# EasyEDA schematic SCH_Media-Remote_2024-07-10.json
TITLE: LoeMediaRemote; REV: 1.0; Date: 2024-07-08; Sheet: 1/1
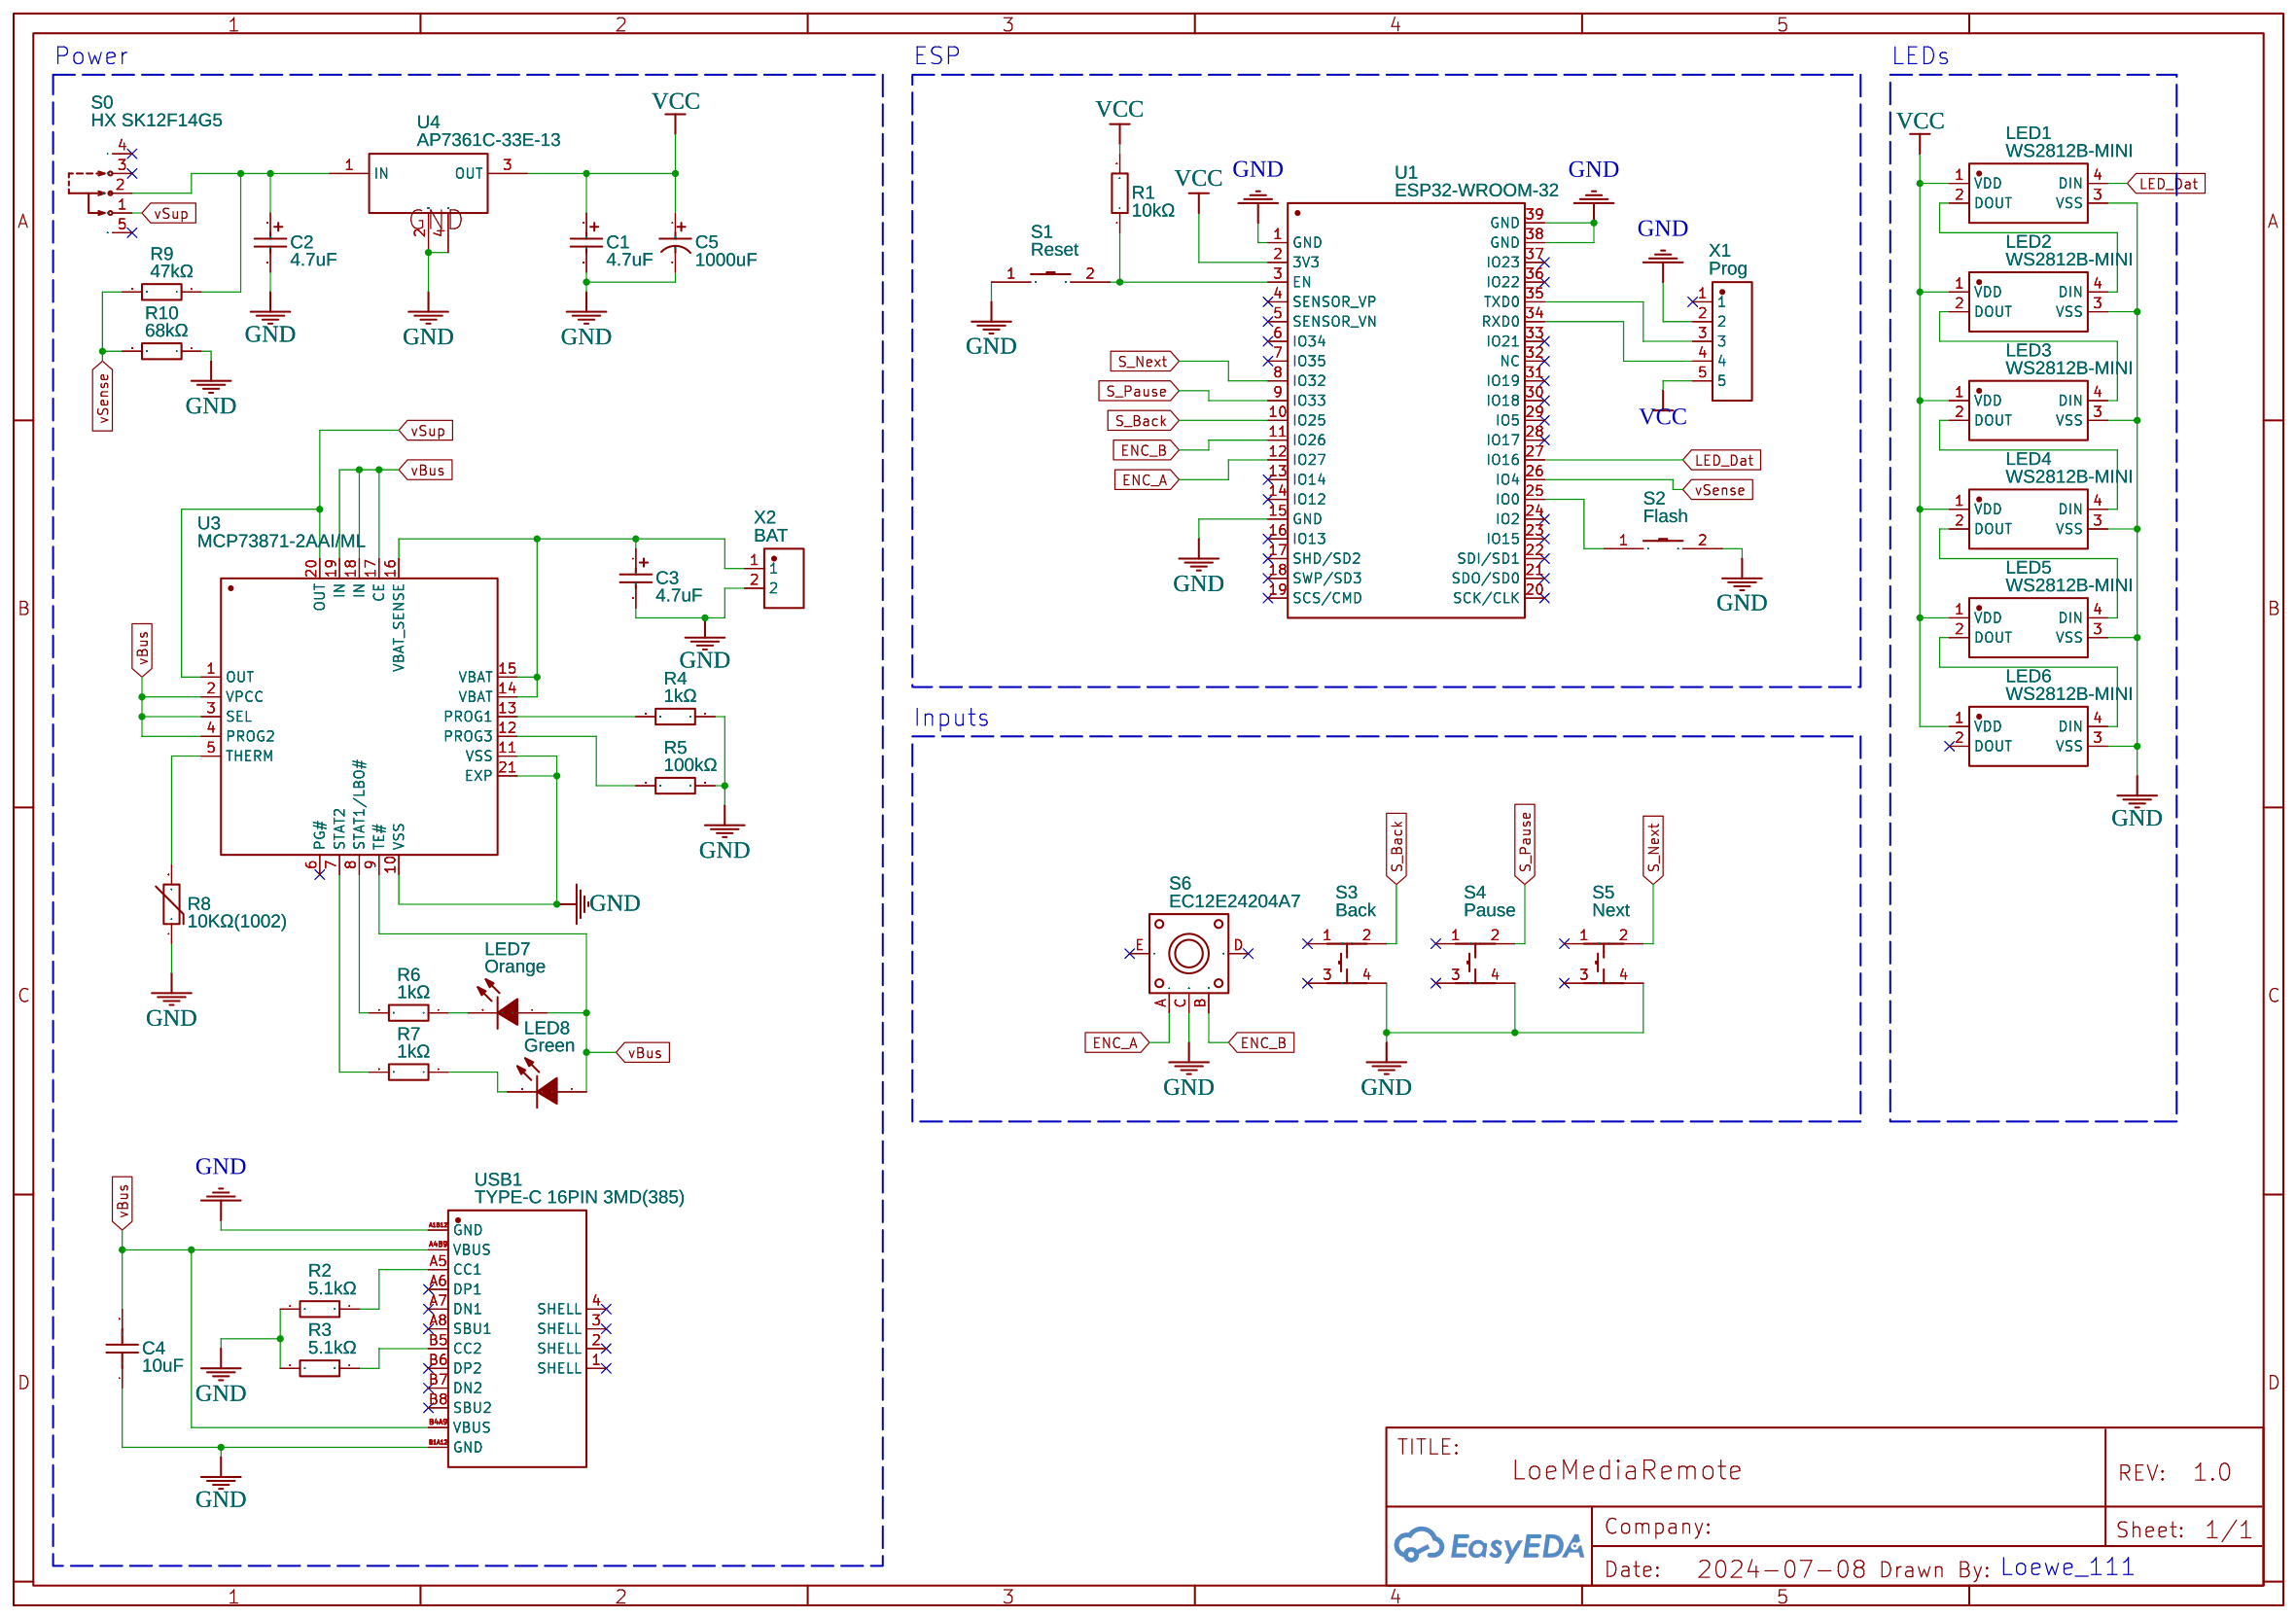
[diagram p0: schematic sheet]

## Parts
C1  4.7uF  [CASE-A_3216]
C2  4.7uF  [CASE-A_3216]
C3  4.7uF  [CASE-A_3216]
C4  10uF  [C0603]
C5  1000uF  [CAP-SMD_BD10.0-L10.3-W10.3-LS11.3-FD]
LED1  WS2812B-MINI  [LED-SMD_4P-L3.5-W3.5-TL_WS2812B]
LED2  WS2812B-MINI  [LED-SMD_4P-L3.5-W3.5-TL_WS2812B]
LED3  WS2812B-MINI  [LED-SMD_4P-L3.5-W3.5-TL_WS2812B]
LED4  WS2812B-MINI  [LED-SMD_4P-L3.5-W3.5-TL_WS2812B]
LED5  WS2812B-MINI  [LED-SMD_4P-L3.5-W3.5-TL_WS2812B]
LED6  WS2812B-MINI  [LED-SMD_4P-L3.5-W3.5-TL_WS2812B]
LED7  Orange  [LED0603-R-RD_ORANGE]
LED8  Green  [LED0603-R-RD_GREEN]
R1  10kΩ  [R0603]
R2  5.1kΩ  [R0603]
R3  5.1kΩ  [R0603]
R4  1kΩ  [R0603]
R5  100kΩ  [R0603]
R6  1kΩ  [R0603]
R7  1kΩ  [R0603]
R8  10KΩ(1002)  [R0603]
R9  47kΩ  [R0603]
R10  68kΩ  [R0603]
S0  HX SK12F14G5  [SW-TH_SK12F14G5]
S1  Reset  [SW-SMD_L6.0-W3.3-LS8.0]
S2  Flash  [SW-SMD_L6.0-W3.3-LS8.0]
S3  Back  [KEY-SMD_4P-L12.0-W12.0-P5.00-LS15.2]
S4  Pause  [KEY-SMD_4P-L12.0-W12.0-P5.00-LS15.2]
S5  Next  [KEY-SMD_4P-L12.0-W12.0-P5.00-LS15.2]
S6  EC12E24204A7  [SW-TH_EC12EXXXX]
U1  ESP32-WROOM-32  [WIFIM-SMD_ESP32-WROOM-32-N4]
U3  MCP73871-2AAI/ML  [QFN-20_L4.0-W4.0-P0.50-TL-EP2.6]
U4  AP7361C-33E-13  [SOT-223_L6.5-W3.5-P2.30-LS7.0-BR]
USB1  TYPE-C 16PIN 3MD(385)  [USB-C-SMD_TYPE-C16PIN]
X1  Prog  [HDR-SMD_X6511WVS-05H-C60D48R1]
X2  BAT  [CONN-TH_2P-P2.50_HX25003-2A]

## Library data of the parts
C1-C3 = CA45-A-16V-4.7UF-K: Contributor: LCSC; Supplier: LCSC; Manufacturer: CEC(振华新云); Manufacturer Part: CA45-A-16V-4.7uF-K; Supplier Part: C129235; JLCPCB Part Class: Extended Part
C4 = CL10A106MP8NNNC: Supplier: LCSC; Manufacturer: SAMSUNG(三星); Supplier Part: C85713; JLCPCB Part Class: Extended Part
C5 = RVT1C102M1010: Supplier: LCSC; Manufacturer: ROQANG(容强); Supplier Part: C72470; JLCPCB Part Class: Extended Part
LED1-LED6 = WS2812B-MINI: Contributor: LCSC; Supplier: LCSC; Supplier Part: C527089; Manufacturer: worldsemi; Manufacturer Part: WS2812B-MINI-V3/W; JLCPCB Part Class: Extended Part
LED7 = SZYY0603O: Contributor: LCSC; Supplier: LCSC; Supplier Part: C434425; Manufacturer: yongyu(永裕光电); JLCPCB Part Class: Extended Part
LED8 = SZYY0603G: Contributor: LCSC; Supplier: LCSC; Supplier Part: C434420; Manufacturer: yongyu(永裕光电); JLCPCB Part Class: Extended Part
R1 = 0603WAF1002T5E: Supplier: LCSC; Manufacturer: UNI-ROYAL(厚声); Supplier Part: C25804; JLCPCB Part Class: Basic Part
R2 R3 = 0603WAF5101T5E: Supplier: LCSC; Manufacturer: UNI-ROYAL(厚声); Supplier Part: C23186; JLCPCB Part Class: Basic Part
R4 R6 R7 = RC0603FR-071KL: Supplier: LCSC; Manufacturer: YAGEO(国巨); Supplier Part: C22548; JLCPCB Part Class: Extended Part
R5 = RC0603FR-07100KL: Contributor: LCSC; Supplier: LCSC; Supplier Part: C14675; Manufacturer: YAGEO(国巨); JLCPCB Part Class: Extended Part
R8 = NCP18XH103F03RB: Supplier: LCSC; Manufacturer: muRata(村田); Supplier Part: C13564; JLCPCB Part Class: Extended Part
R9 = RC0603FR-0747KL: Supplier: LCSC; Manufacturer: YAGEO(国巨); Supplier Part: C105579; JLCPCB Part Class: Extended Part
R10 = RC0603FR-0768KL: JLCPCB Part Class: Extended Part; Supplier: LCSC; Manufacturer: YAGEO(国巨); Supplier Part: C114633
S0 = HX SK12F14G5: Contributor: lcsc; Supplier: LCSC; Supplier Part: C5149842; Manufacturer: hanxia(韩下); JLCPCB Part Class: Extended Part
S1 S2 = TS-1101-C-W: Contributor: LCSC; Supplier: LCSC; Supplier Part: C318938; Manufacturer: XKB Connectivity(中国星坤); JLCPCB Part Class: Extended Part
S3-S5 = TS-1094TS-B3D2: Contributor: lcsc; Supplier: LCSC; Supplier Part: C5148426; Manufacturer: Yuandi(元迪); JLCPCB Part Class: Extended Part
S6 = EC12E24204A7: Contributor: LCSC; Supplier: LCSC; Supplier Part: C470597; Manufacturer: ALPSALPINE(阿尔卑斯阿尔派); JLCPCB Part Class: Extended Part
U1 = ESP32-WROOM-32: Contributor: LCSC; Supplier: LCSC; Supplier Part: C82899; Manufacturer: ESPRESSIF(乐鑫); Manufacturer Part: ESP32-WROOM-32-N4; JLCPCB Part Class: Extended Part
U3 = MCP73871-2AAI/ML: Contributor: LCSC; Supplier: LCSC; Manufacturer: MICROCHIP(美国微芯); Supplier Part: C144351; JLCPCB Part Class: Extended Part
U4 = AP7361C-33E-13: Contributor: LCSC; Supplier: LCSC; Supplier Part: C500795; Manufacturer: Diodes Incorporated; JLCPCB Part Class: Extended Part
USB1 = TYPE-C 16PIN 3MD(385): Contributor: LCSC; Supplier: LCSC; Supplier Part: C2858270; Manufacturer: SHOU HAN(首韩); JLCPCB Part Class: Extended Part
X1 = X6511WVS-05H-C60D48R1: Contributor: LCSC; Supplier: LCSC; Supplier Part: C2883802; Manufacturer: XKB Connection(中国星坤); JLCPCB Part Class: Extended Part
X2 = ZX-XH2.54-2PZZ: Supplier: LCSC; Supplier Part: C7429632; Manufacturer: Megastar(兆星); JLCPCB Part Class: Extended Part; Contributor: lcsc

## Nets
GND: C1.2 C2.2 C3.2 C4.1 C5.2 LED1.3(VSS) LED2.3(VSS) LED3.3(VSS) LED4.3(VSS) LED5.3(VSS) LED6.3(VSS) R2.2 R3.2 R4.1 R5.1 R8.1 R10.1 S1.1 S2.2 S3.4 S4.4 S5.4 S6.C U1.1(GND) U1.15(GND) U1.38(GND) U1.39(GND) U3.10(VSS) U3.11(VSS) U3.21(EXP) U4.2(GND) U4.4(GND) USB1.A1B12(GND) USB1.B1A12(GND) X1.2 X2.2
vBus: C4.2 LED7.1(+) LED8.1(+) U3.2(VPCC) U3.3(SEL) U3.4(PROG2) U3.9(TE#) U3.17(CE) U3.18(IN) U3.19(IN) USB1.A4B9(VBUS) USB1.B4A9(VBUS)
VCC: C1.1 C5.1 LED1.1(VDD) LED2.1(VDD) LED3.1(VDD) LED4.1(VDD) LED5.1(VDD) LED6.1(VDD) R1.2 U1.2(3V3) U4.3(OUT) X1.5
ENC_A: S6.A U1.12(IO27)
ENC_B: S6.B U1.11(IO26)
LED_Dat: LED1.4(DIN) U1.27(IO16)
S_Back: S3.2 U1.10(IO25)
S_Next: S5.2 U1.8(IO32)
S_Pause: S4.2 U1.9(IO33)
vSense: R9.2 R10.2 U1.26(IO4)
vSup: S0.1 U3.1(OUT) U3.20(OUT)
Net-(C2-1): C2.1 R9.1 S0.2 U4.1(IN)
Net-(C3-1): C3.1 U3.14(VBAT) U3.15(VBAT) U3.16(VBAT_SENSE) X2.1
Net-(LED1-2): LED1.2(DOUT) LED2.4(DIN)
Net-(LED2-2): LED2.2(DOUT) LED3.4(DIN)
Net-(LED3-2): LED3.2(DOUT) LED4.4(DIN)
Net-(LED4-2): LED4.2(DOUT) LED5.4(DIN)
Net-(LED5-2): LED5.2(DOUT) LED6.4(DIN)
Net-(LED7-2): LED7.2(-) R6.1
Net-(LED8-2): LED8.2(-) R7.1
Net-(R1-1): R1.1 S1.2 U1.3(EN)
Net-(R2-1): R2.1 USB1.A5(CC1)
Net-(R3-1): R3.1 USB1.B5(CC2)
Net-(R4-2): R4.2 U3.13(PROG1)
Net-(R5-2): R5.2 U3.12(PROG3)
Net-(R6-2): R6.2 U3.8(STAT1/LBO#)
Net-(R7-2): R7.2 U3.7(STAT2)
Net-(R8-2): R8.2 U3.5(THERM)
Net-(S2-1): S2.1 U1.25(IO0)
Net-(U1-34): U1.34(RXD0) X1.4
Net-(U1-35): U1.35(TXD0) X1.3

Not connected (* = marked no-connect by the designer): LED6 2(DOUT)*; S0 3* 4* 5*; S3 1* 3*; S4 1* 3*; S5 1* 3*; S6 D* E*; U1 4(SENSOR_VP)* 5(SENSOR_VN)* 6(IO34)* 7(IO35)* 13(IO14)* 14(IO12)* 16(IO13)* 17(SHD/SD2)* 18(SWP/SD3)* 19(SCS/CMD)* 20(SCK/CLK)* 21(SDO/SD0)* 22(SDI/SD1)* 23(IO15)* 24(IO2)* 28(IO17)* 29(IO5)* 30(IO18)* 31(IO19)* 32(NC)* 33(IO21)* 36(IO22)* 37(IO23)*; U3 6(PG#)*; USB1 1(SHELL)* 2(SHELL)* 3(SHELL)* 4(SHELL)* A6(DP1)* A7(DN1)* A8(SBU1)* B6(DP2)* B7(DN2)* B8(SBU2)*; X1 1*

## Notes on the sheet
- Power
- ESP
- LEDs
- Inputs
- Loewe_111
